# EAGLE design bga_test (EAGLE 6.4)
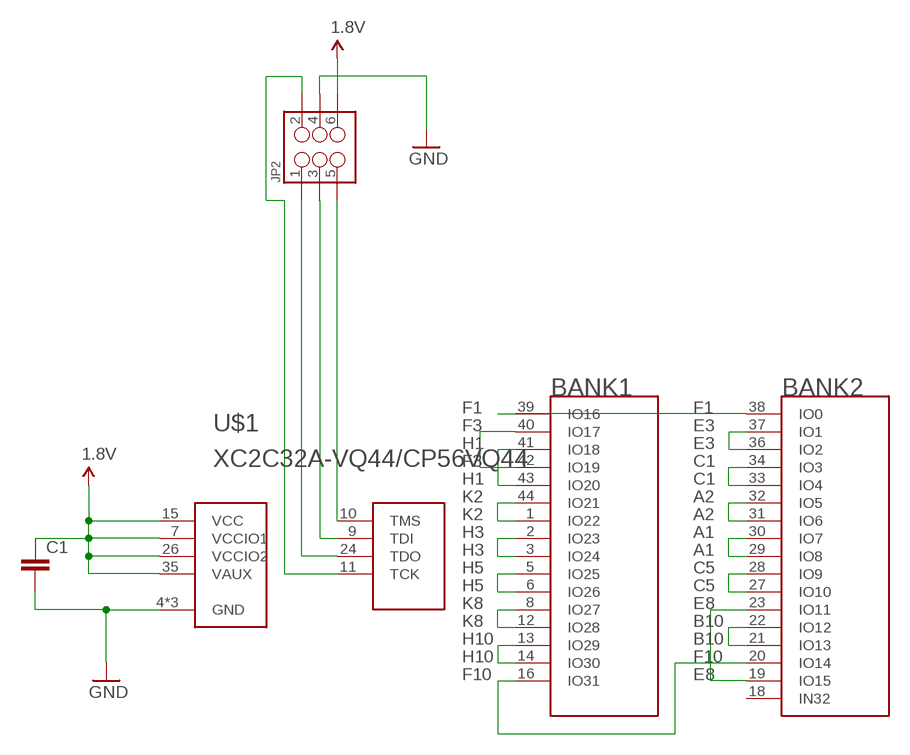
[diagram p0: schematic, sheet 1]

## Parts
C1  CAP0402-CAP  [0402-CAP]
JP2  M03X2NO_SILK  [2X3-NS]
U$1  XC2C32A-VQ44/CP56VQ44  [XILINX_VQ44]

## Nets
1.8V: C1.1 JP2.6 U$1.7(VCCIO1) U$1.15(VCC) U$1.26(VCCIO2) U$1.35(VAUX)
A1: U$1.29(IO8) U$1.30(IO7)
A2: U$1.31(IO6) U$1.32(IO5)
B10: U$1.21(IO13) U$1.22(IO12)
C1: U$1.33(IO4) U$1.34(IO3)
C5: U$1.27(IO10) U$1.28(IO9)
E3: U$1.36(IO2) U$1.37(IO1)
E8: U$1.19(IO15) U$1.23(IO11)
F1: U$1.38(IO0) U$1.39(IO16)
F3: U$1.40(IO17) U$1.42(IO19)
F10: U$1.16(IO31) U$1.20(IO14)
GND: C1.2 JP2.4 U$1.4(GND) U$1.17(GND) U$1.25(GND)
H1: U$1.41(IO18) U$1.43(IO20)
H3: U$1.2(IO23) U$1.3(IO24)
H5: U$1.5(IO25) U$1.6(IO26)
H10: U$1.13(IO29) U$1.14(IO30)
K2: U$1.1(IO22) U$1.44(IO21)
K8: U$1.8(IO27) U$1.12(IO28)
TCK: JP2.2 U$1.11(TCK)
TDI: JP2.3 U$1.9(TDI)
TDO: JP2.1 U$1.24(TDO)
TMS: JP2.5 U$1.10(TMS)
Unconnected: U$1.18(IN32)

## Library data of the parts
C1 = SparkFun-Capacitors:CAP: Capacitor Standard 0603 ceramic capacitor, and 0.1" leaded capacitor.
JP2 = SparkFun-Connectors:M03X2: 2x3 .1" header. Shrouded, with keying- CONN-10681 SMT- CONN-11415 Pogo pins- HW-11044
U$1 = kmod-xilinx:XC2C32A-VQ44/CP56: XC2C32A, with support for the VQ44 and CP56 footprints

## Board
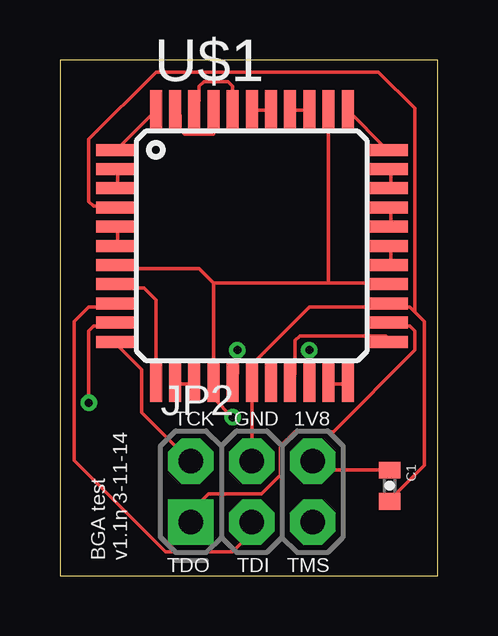
[diagram p1: board, top side]
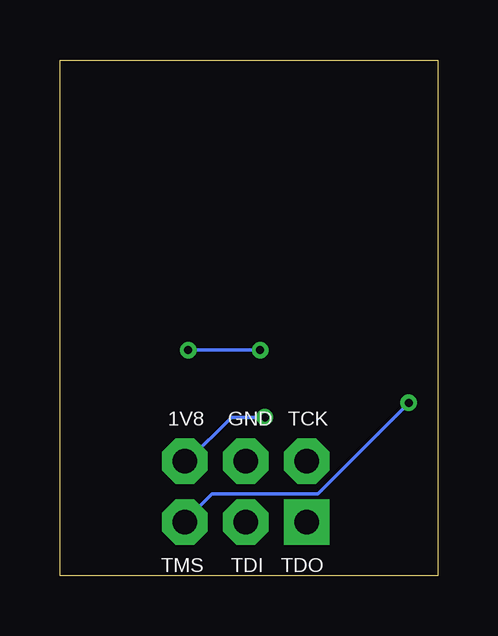
[diagram p2: board, bottom side, seen from below]

Size 15.75 x 21.5 mm. Coordinates in mm from the lower left corner, seen from the top.
Outline: 0,0 15.75,0 15.75,21.5 0,21.5 0,0
Copper layers (1*16): Top 0.0356mm / dielectric 1.5011mm / Bottom 0.0356mm
Design rules "OSHPark_mine": minimum track width 6mil, minimum drill 13mil, track to track 6mil, track to pad 6mil, pad to pad 6mil, via to via 6mil, smd to smd 6mil, copper to edge 15mil, drill to drill 6mil, minimum pad ring 7mil, minimum via ring 7mil, stop-mask expansion 2mil, vias tented up to drill 13mil, thermal gap 10mil

### Footprints (pad centres in the part's own frame; a part is rotated, then mirrored left to right if it is on the bottom)
0402-CAP = smd 0.7 x 0.9: 1 -0.65,0; 2 0.65,0
2X3-NS = drill 1.016 pad 1.88 square: 1 -2.54,-1.27 | drill 1.016 pad 1.88 octagon: 2 -2.54,1.27; 3 0,-1.27; 4 0,1.27; 5 2.54,-1.27; 6 2.54,1.27
XILINX_VQ44 = smd 1.6 x 0.5: 1 -5.7,4; 2 -5.7,3.2; 3 -5.7,2.4; 4 -5.7,1.6; 5 -5.7,0.8; 6 -5.7,0; 7 -5.7,-0.8; 8 -5.7,-1.6; 9 -5.7,-2.4; 10 -5.7,-3.2; 11 -5.7,-4; 23 5.7,-4; 24 5.7,-3.2; 25 5.7,-2.4; 26 5.7,-1.6; 27 5.7,-0.8; 28 5.7,0; 29 5.7,0.8; 30 5.7,1.6; 31 5.7,2.4; 32 5.7,3.2; 33 5.7,4 | smd 0.5 x 1.6: 12 -4,-5.7; 13 -3.2,-5.7; 14 -2.4,-5.7; 15 -1.6,-5.7; 16 -0.8,-5.7; 17 0,-5.7; 18 0.8,-5.7; 19 1.6,-5.7; 20 2.4,-5.7; 21 3.2,-5.7; 22 4,-5.7; 34 4,5.7; 35 3.2,5.7; 36 2.4,5.7; 37 1.6,5.7; 38 0.8,5.7; 39 0,5.7; 40 -0.8,5.7; 41 -1.6,5.7; 42 -2.4,5.7; 43 -3.2,5.7; 44 -4,5.7

### Placement (x,y rotation side)
C1  13.75,3.75 270 top
JP2  8,3.5 0 top
U$1  8,13.75 0 top

### Tracks (layer width: path | path; a pad name or v marks a point on that pad's centre or on a via)
1.8V  (via drill 0.33)
  Top 0.152: C1.1 10.6,4.4 10.6,4.6 JP2.6 | 6.4,12.2 5.8,12.8 2.4,12.8 U$1.7 | 6.4,12.2 U$1.15 6.4,7.4 v7.2,6.6 | 6.4,12.2 11.2,12.2 | 11.2,12.2 13.6,12.2 U$1.26 | 11.2,12.2 U$1.35
  Bottom 0.152: v7.2,6.6 8.6,6.6 10.4,4.8 JP2.6
A1
  Top 0.152: U$1.29 13.8,14.6 13.8,15.2 U$1.30
A2
  Top 0.152: U$1.31 13.8,16.2 13.8,16.8 U$1.32
B10
  Top 0.152: U$1.21 11.2,8 12,8 U$1.22
C1
  Top 0.152: U$1.34 12,19.4 13.6,17.8 U$1.33
C5
  Top 0.152: U$1.27 13.8,13 13.8,13.6 U$1.28
E3
  Top 0.152: U$1.37 9.6,19.4 10.4,19.4 U$1.36
E8
  Top 0.152: U$1.19 9.6,8.2 9.8,8.4 9.8,9.8 10,10 13.6,10 13.6,9.8 U$1.23
F1
  Top 0.152: U$1.39 8,19.4 8.8,19.4 U$1.38
F3
  Top 0.152: U$1.40 7.2,20.4 7,20.6 6,20.6 5.8,20.4 5.8,19.8 5.6,19.6 U$1.42
F10  (via drill 0.33)
  Top 0.152: v7.4,9.4 7.4,8.4 7.2,8.2 U$1.16 | U$1.20 v10.4,9.4
  Bottom 0.152: v10.4,9.4 v7.4,9.4
GND
  Top 0.152: JP2.4 U$1.17 8,8.2 8.2,8.4 8.2,9 10.4,11.2 13.6,11.2 U$1.25 13.8,11.2 14.6,11.2 14.8,11 | 14.8,11 15.2,10.6 15.2,4.6 13.8,3.2 C1.2 | 14.8,11 14.8,19.49 13.29,21 4,21 1.2,18.2 1.2,15.6 1.4,15.4 2.2,15.4 U$1.4
H1
  Top 0.152: U$1.41 6.4,18.4 5.2,18.4 5,18.6 5,19.2 4.8,19.4 U$1.43
H3
  Top 0.152: U$1.3 2.4,16.2 2.4,16.8 U$1.2
H5
  Top 0.152: U$1.6 2.4,13.8 2.4,14.4 U$1.5
H10
  Top 0.152: U$1.13 4.8,8 5.6,8 U$1.14
K2
  Top 0.152: U$1.1 2.4,17.8 4,19.4 U$1.44
K8
  Top 0.152: U$1.12 4,11.5 3.5,12 2.4,12 U$1.8
TCK
  Top 0.152: U$1.11 2.4,9.6 3.4,8.6 3.4,6.8 5.4,4.8 JP2.2
TDI
  Top 0.152: JP2.3 8,1.8 7.2,1 4.4,1 0.6,4.8 0.6,10.6 1.2,11.2 2.2,11.2 U$1.9
TDO
  Top 0.152: U$1.24 13.8,10.4 14.6,10.4 14.8,10.2 14.8,9.4 11.4,6 9.8,6 9.2,5.4 9.2,4.2 8.4,3.4 6.2,3.4 5.6,2.8 5.6,2.4 JP2.1
TMS  (via drill 0.33)
  Top 0.152: v1.2,7.2 1.2,10.2 1.4,10.4 2.2,10.4 U$1.10
  Bottom 0.152: v1.2,7.2 5,3.4 9.4,3.4 10.4,2.4 JP2.5

### Text on the board
tPlace: TCK | GND | 1V8 | BGA test / v1.1n 3-11-14 | TDO | TDI | TMS
bPlace: TCK | GND | 1V8 | TDO | TDI | TMS